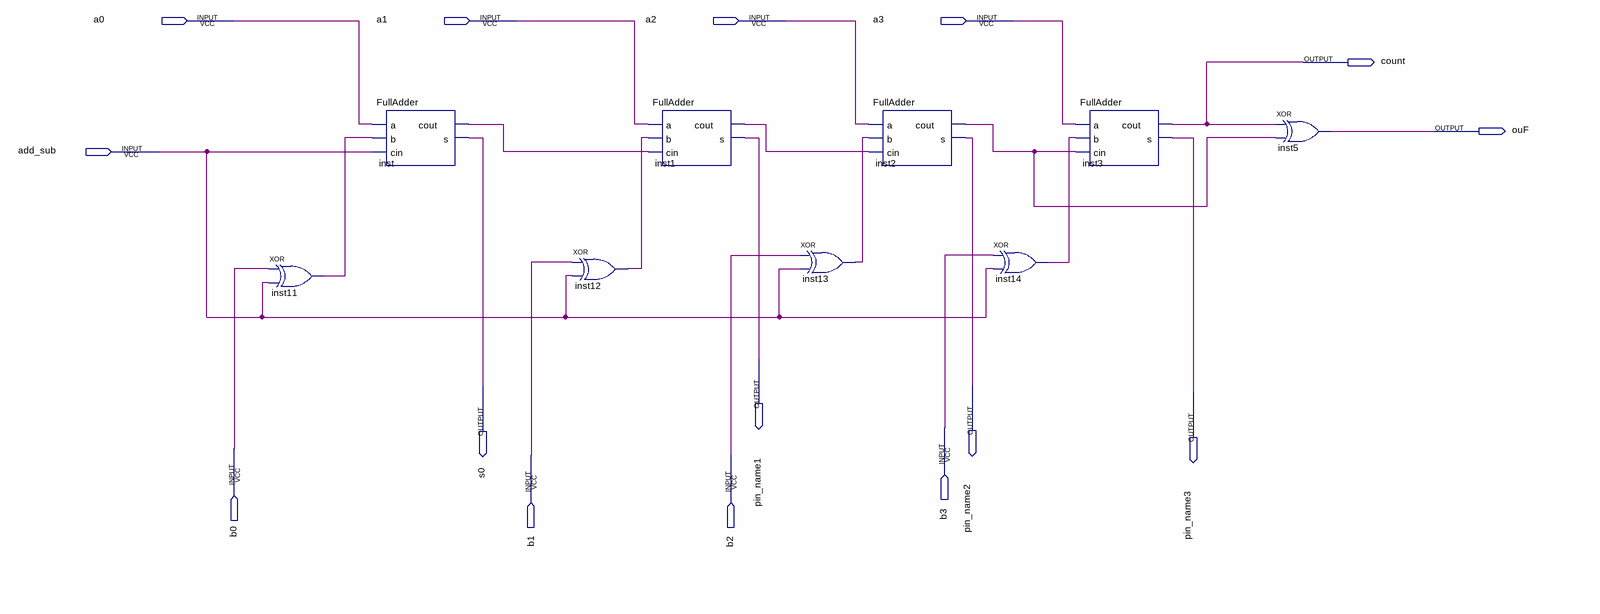
[diagram p0: schematic sheet]
// Quartus schematic AddSub4.bdf as structural Verilog: 9 symbols, 15 pins
module AddSub4 (
  input  a0,
  input  a1,
  input  a2,
  input  a3,
  input  add_sub,
  input  b3,
  input  b0,
  input  b1,
  input  b2,
  output count,
  output ouF,
  output pin_name1,
  output s0,
  output pin_name2,
  output pin_name3
);

  wire inst1_cout, inst2_cout, inst11_out, inst12_out, inst13_out, inst14_out, inst_cout;

  xor inst11 (inst11_out, b0, add_sub);
  FullAdder inst (.a(a0), .b(inst11_out), .cin(add_sub), .cout(inst_cout), .s(s0));
  xor inst12 (inst12_out, b1, add_sub);
  FullAdder inst1 (.a(a1), .b(inst12_out), .cin(inst_cout), .cout(inst1_cout), .s(pin_name1));
  xor inst13 (inst13_out, b2, add_sub);
  FullAdder inst2 (.a(a2), .b(inst13_out), .cin(inst1_cout), .cout(inst2_cout), .s(pin_name2));
  xor inst14 (inst14_out, b3, add_sub);
  FullAdder inst3 (.a(a3), .b(inst14_out), .cin(inst2_cout), .cout(count), .s(pin_name3));
  xor inst5 (ouF, count, inst2_cout);
endmodule
